# Altium schematic sheet Power.SchDoc
size A; SheetNumber: 2; SheetTotal: 3
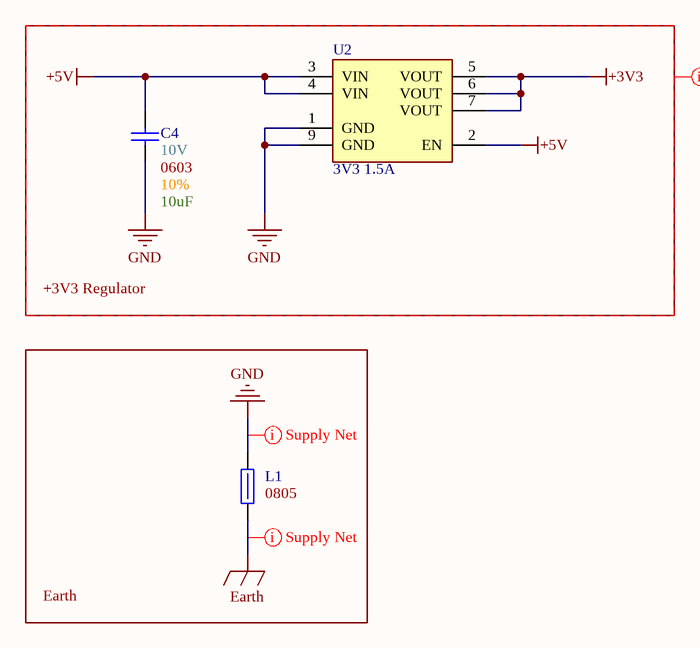
[diagram p0: Power.SchDoc]

## Parts
C4  Max Voltage: 10V  Size Package: 0603  Tolerance: 10%  Capacitance: 10uF  [[Cap] SMD 0603]  (hidden comment: [Cap] 0603 10uF 10% 10V)
L1  Size Package: 0805  [[Ferrite] SMD 0805]  (hidden comment: 652-MH2029-300Y)
U2  3V3 1.5A  [[Linear] 3V3 1.5A]

## Blocks framed on the sheet
+3V3 Regulator: C4 U2
Earth: L1

## Nets
+3V3: U2.5(VOUT) U2.6(VOUT) U2.7(VOUT)
+5V: C4.2 U2.2(EN) U2.3(VIN) U2.4(VIN)
Earth: L1.1
GND: C4.1 L1.2 U2.1(GND) U2.9(GND)

## Layout directives
net class Supply_Nets: +3V3, +5V, Earth, GND

## Library data of the parts
C4 = [Cap] 0603 10uF 10% 10V: CL10A106KP8NNNC; Supplier 1: DigiKey; Supplier Part Number 1: 1276-1192-6-ND
L1 = [Ferrite] SMD 0805 3A 30ohm: Res @ Freq: 30 @ 100MHz; Supplier 1: DigiKey; Supplier Part Number 1: MH2029-300YCT-ND
U2 = [Linear] 3V3 1.5A: AP7362A-33SP-13; Supplier 1: DigiKey; Supplier Part Number 1: AP7362A-33SP-13DICT-ND